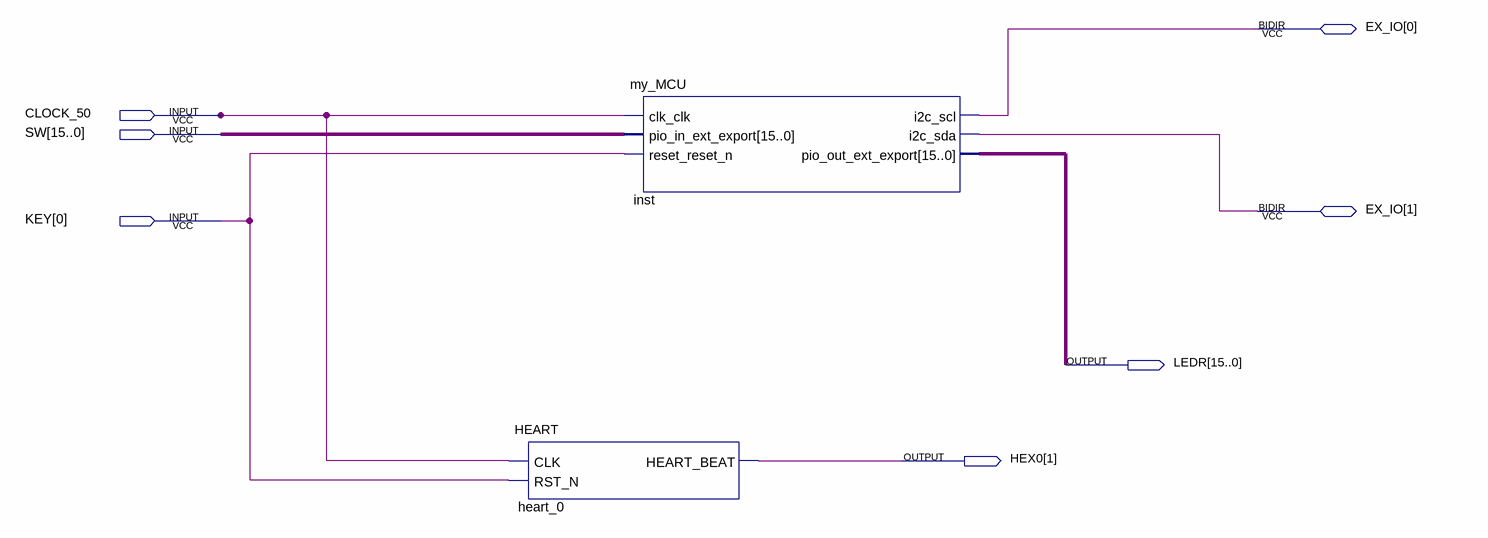
[diagram p0: schematic sheet]
// Quartus schematic Oblig3_TOP.bdf as structural Verilog: 2 symbols, 7 pins
module Oblig3_TOP (
  input  CLOCK_50,
  input  [15:0] SW,
  input  [0:0] KEY,
  inout  [1:0] EX_IO,
  output [15:0] LEDR,
  output [1:1] HEX0
);

  HEART heart_0 (.CLK(CLOCK_50), .RST_N(KEY[0]), .HEART_BEAT(HEX0[1]));
  my_MCU inst (
    .clk_clk(CLOCK_50), .pio_in_ext_export(SW), .reset_reset_n(KEY[0]), .i2c_scl(EX_IO[0]),
    .pio_out_ext_export(LEDR), .i2c_sda(EX_IO[1]));
endmodule
